# EAGLE design Motor Board (EAGLE 7.2.0)
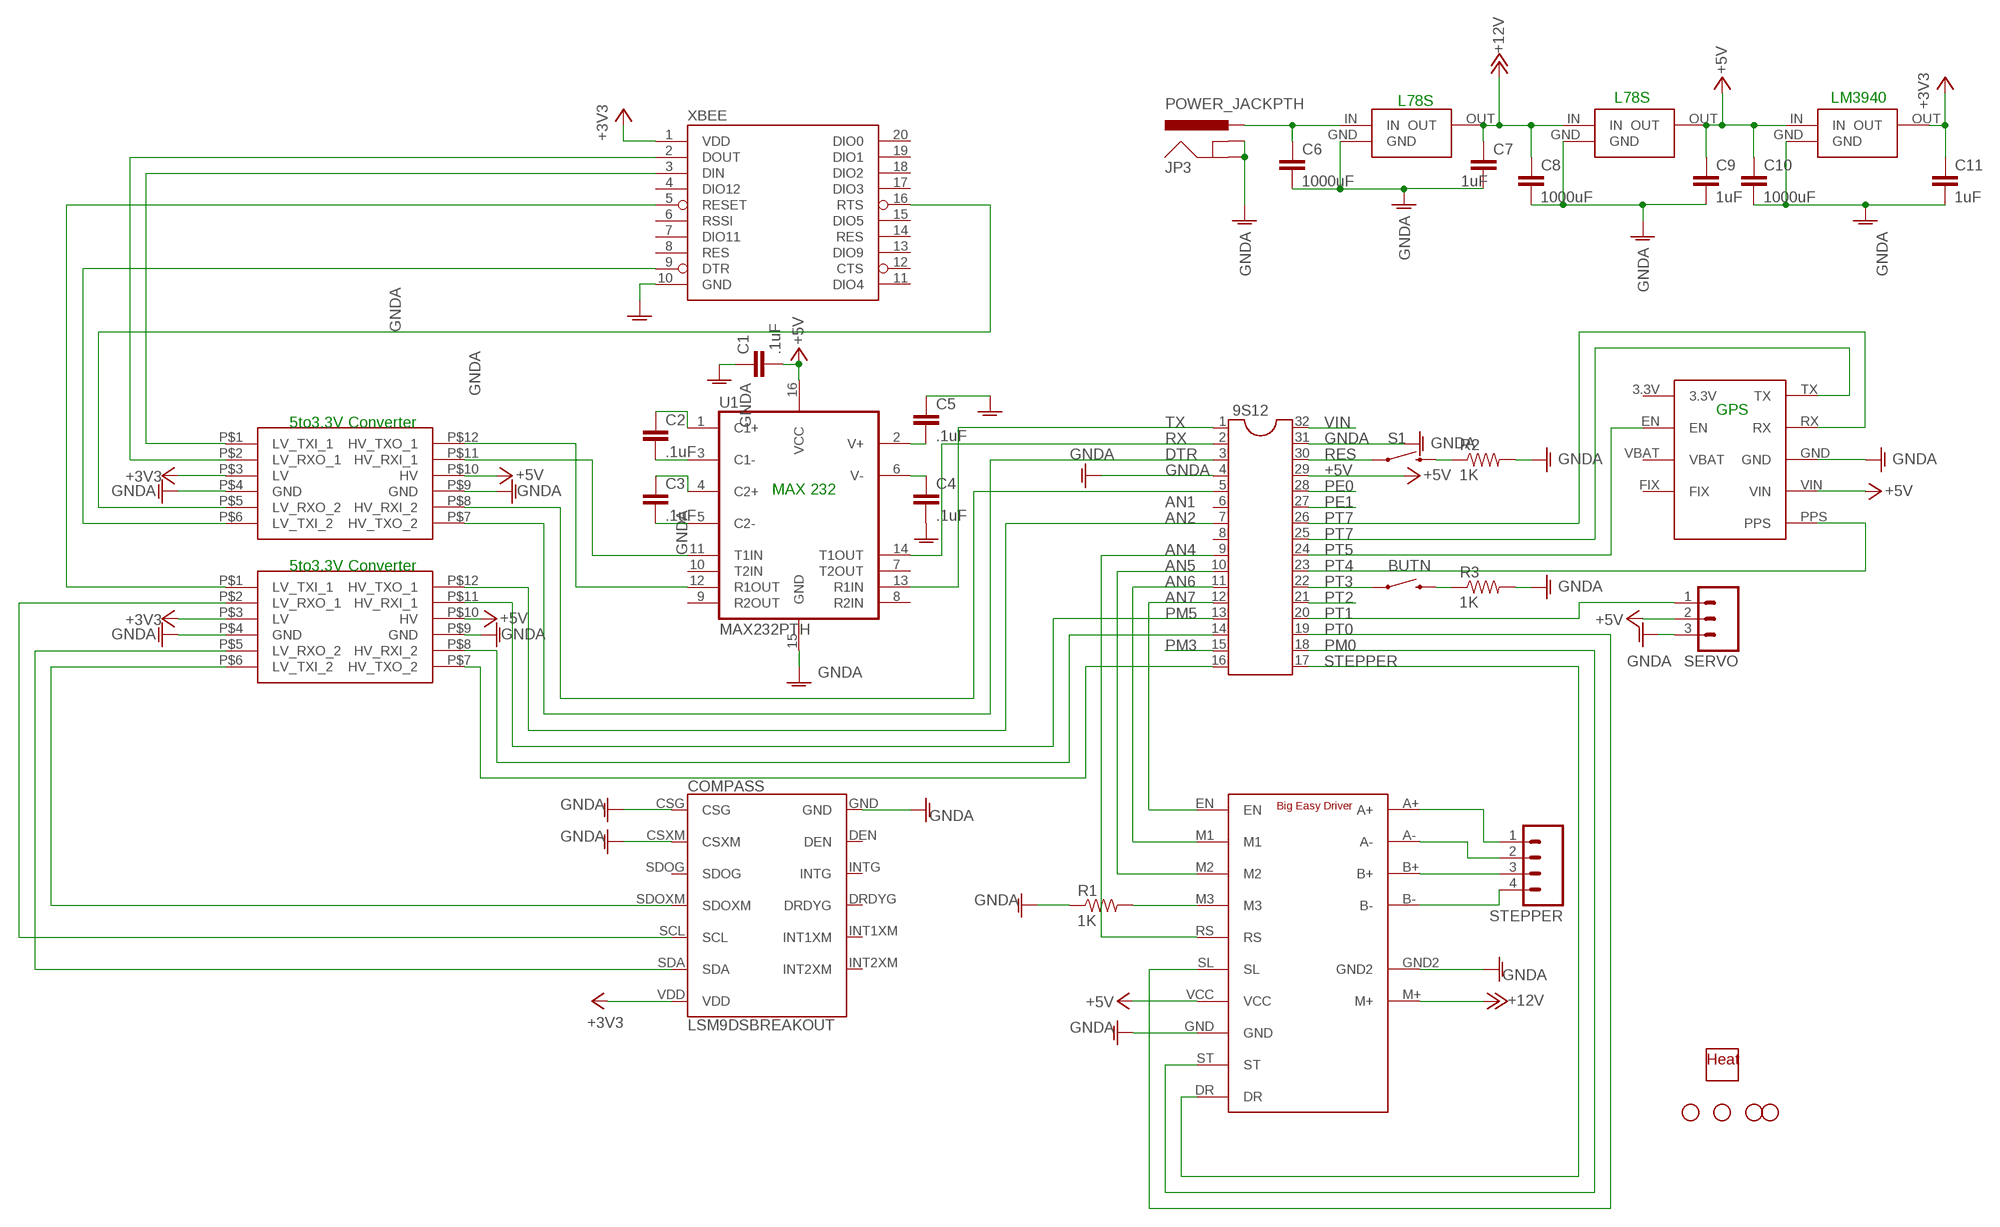
[diagram p0: schematic, sheet 1]

## Parts
9S12  DIL32  [DIL32]
BUTN  EXTERNALBUTTON  [EXTERNALBUTTON]
C1  .1uF  CAPPTH  [CAP-PTH-SMALL]
C2  .1uF  CAPPTH  [CAP-PTH-SMALL]
C3  .1uF  CAPPTH  [CAP-PTH-SMALL]
C4  .1uF  CAPPTH  [CAP-PTH-SMALL]
C5  .1uF  CAPPTH  [CAP-PTH-SMALL]
C6  1000uF  CAP_2000UF  [CAP]
C7  1uF  CAPPTH  [CAP-PTH-SMALL]
C8  1000uF  CAP_2000UF  [CAP]
C9  1uF  CAPPTH  [CAP-PTH-SMALL]
C10  1000uF  CAP_2000UF  [CAP]
C11  1uF  CAPPTH  [CAP-PTH-SMALL]
COMPASS  LSM9DSBREAKOUT  [IMUBREAKOUT]
JP3  POWER_JACKPTH  [POWER_JACK_PTH]
R1  1K  RESISTORPTH-1/4W  [AXIAL-0.4]
R2  1K  RESISTORPTH-1/4W  [AXIAL-0.4]
R3  1K  RESISTORPTH-1/4W  [AXIAL-0.4]
REG_5TO3.3  POWERREG_5TO3.3_NOHEAT  [POWERREG_NOHEAT]
REG_12TO5  POWERREG_12TO5  [POWERREG]
REG_18TO12  POWERREG18VTO12V  [POWERREG]
S1  SWITCH-MOMENTARY-2PTH  [TACTILE-PTH]
SERVO  M03PTH  [1X03]
STANDOFF1  STAND-OFF  [STAND-OFF]
STANDOFF2  STAND-OFF  [STAND-OFF]
STANDOFF3  STAND-OFF  [STAND-OFF]
STANDOFF4  STAND-OFF  [STAND-OFF]
STEPPER  M04NO_SILK_ALL_ROUND  [1X04_NO_SILK_ALL_ROUND]
U1  MAX232PTH  [DIL16]
U$1  5to3.3  LOGIC_LEVEL_CONVERTER  [LOGIC_LEVEL_CONVERTER]
U$2  5to3.3  LOGIC_LEVEL_CONVERTER  [LOGIC_LEVEL_CONVERTER]
U$3  BIGEASYDRIVER  [BIGEASYDRIVER]
U$4  GPS  [GPS]
U$9  HEATSINK  [HEATSINK]
XBEE  XBEE-1B1  [XBEE-1]

## Nets
+3V3: C11.1 COMPASS.VDD REG_5TO3.3.OUT U$1.P$3(LV) U$2.P$3(LV) XBEE.1(VDD)
+5V: 9S12.29 C1.2 C9.1 C10.1 REG_5TO3.3.IN REG_12TO5.OUT SERVO.2 U1.16(VCC) U$1.P$10(HV) U$2.P$10(HV) U$3.VCC U$4.VIN
+12V: C7.1 C8.1 REG_12TO5.IN REG_18TO12.OUT U$3.M+
A+: STEPPER.1 U$3.A+
A-: STEPPER.2 U$3.A-
AN0: U$2.P$5(LV_RXO_2) XBEE.16(RTS)
AN1: U$2.P$6(LV_TXI_2) XBEE.9(DTR)
AN2: U$1.P$1(LV_TXI_1) XBEE.5(RESET)
AN4: 9S12.9 U$3.RS
AN5: 9S12.10 U$3.M2
AN6: 9S12.11 U$3.M1
AN7: 9S12.12 U$3.EN
B-: STEPPER.4 U$3.B-
DTR: 9S12.3 U$2.P$7(HV_TXO_2)
GNDA: 9S12.4 9S12.31 C1.1 C4.2 C5.1 C6.2 C7.2 C8.2 C9.2 C10.2 C11.2 COMPASS.CSG COMPASS.CSXM COMPASS.GND JP3.GND JP3.GNDBREAK R1.P$1 R2.P$2 R3.P$2 REG_5TO3.3.GND REG_12TO5.GND REG_18TO12.GND SERVO.3 U1.15(GND) U$1.P$4(GND) U$1.P$9(GND) U$2.P$4(GND) U$2.P$9(GND) U$3.GND U$3.GND2 U$4.GND XBEE.10(GND)
N$1: COMPASS.SCL U$1.P$2(LV_RXO_1)
N$2: COMPASS.SDA U$1.P$5(LV_RXO_2)
N$4: 9S12.7 U$1.P$12(HV_TXO_1)
N$5: R1.P$2 U$3.M3
N$7: 9S12.1 U1.13(R1IN)
N$8: 9S12.25 U$4.TX
N$9: STEPPER.3 U$3.B+
N$10: 9S12.2 U1.14(T1OUT)
N$11: 9S12.5 U$2.P$8(HV_RXI_2)
N$12: U1.12(R1OUT) U$2.P$12(HV_TXO_1)
N$13: U1.11(T1IN) U$2.P$11(HV_RXI_1)
N$14: C2.1 U1.1(C1+)
N$15: C2.2 U1.3(C1-)
N$16: C3.2 U1.5(C2-)
N$17: C3.1 U1.4(C2+)
N$18: C5.2 U1.2(V+)
N$19: C4.1 U1.6(V-)
N$20: R2.P$1 S1.3
N$21: C6.1 JP3.PWR REG_18TO12.IN
N$22: BUTN.2 R3.P$1
PE0: 9S12.28
PE1: 9S12.27
PM0: 9S12.18 U$3.ST
PM2: 9S12.16 U$1.P$7(HV_TXO_2)
PM2_NEW: COMPASS.SDOXM U$1.P$6(LV_TXI_2)
PM3: 9S12.15
PM4: 9S12.14 U$1.P$8(HV_RXI_2)
PM5: 9S12.13 U$1.P$11(HV_RXI_1)
PT0: 9S12.19 U$3.SL
PT1: 9S12.20 SERVO.1
PT2: 9S12.21
PT3: 9S12.22 BUTN.1
PT4: 9S12.23 U$4.PPS
PT5: 9S12.24 U$4.EN
PT7: 9S12.26 U$4.RX
RES: 9S12.30 S1.1
RX: U$2.P$2(LV_RXO_1) XBEE.2(DOUT)
STEPPER: 9S12.17 U$3.DR
TX: U$2.P$1(LV_TXI_1) XBEE.3(DIN)
VIN: 9S12.32
Unconnected: 9S12.6 9S12.8 COMPASS.DEN COMPASS.DRDYG COMPASS.INT1XM COMPASS.INT2XM COMPASS.INTG COMPASS.SDOG U1.7(T2OUT) U1.8(R2IN) U1.9(R2OUT) U1.10(T2IN) U$4.3.3V U$4.FIX U$4.VBAT XBEE.4(DIO12) XBEE.6(RSSI) XBEE.7(DIO11) XBEE.8(RES) XBEE.11(DIO4) XBEE.12(CTS) XBEE.13(DIO9) XBEE.14(RES) XBEE.15(DIO5) XBEE.17(DIO3) XBEE.18(DIO2) XBEE.19(DIO1) XBEE.20(DIO0)

## Notes on the sheet
- L78S | L78S | LM3940
- GPS
- 5to3.3V Converter
- MAX 232
- 5to3.3V Converter

## Library data of the parts
9S12 = ic-package:DIL32: Dual In Line
BUTN = ECE 362:EXTERNALBUTTON
C1-C5 C7 C9 C11 = SparkFun-Capacitors:CAP: Capacitor Standard 0603 ceramic capacitor, and 0.1" leaded capacitor.
C6 C8 C10 = ECE 362:CAP_2000UF
COMPASS = ECE 362:LSM9DSBREAKOUT: LSM9DS0 Breakout Board SparkFun's 9 Degrees of Freedom IMU Breakout board
JP3 = SparkFun-Connectors:POWER_JACK: Power Jack This is the standard 5.5mm barrel jack for power. The PTH is the most common, proven, reliable, footprint. The Slot footprint only works if the mill layer is transmitted to the PCB fab house so be warned. Mating wall wart : TOL-00298 (and others); PROD_ID: CONN-08197
R1-R3 = SparkFun-Passives:RESISTOR: Resistor Basic schematic elements and footprints for 0603, 1206, and PTH resistors.
REG_5TO3.3 = ECE 362:POWERREG_5TO3.3_NOHEAT
REG_12TO5 = ECE 362:POWERREG_12TO5
REG_18TO12 = ECE 362:POWERREG18VTO12V
S1 = SparkFun-Electromechanical:SWITCH-MOMENTARY-2: Various NO switches- pushbuttons, reed, etc; PROD_ID: SWCH-08441
SERVO = SparkFun-Connectors:M03: Header 3 Standard 3-pin 0.1" header. Use with straight break away headers (SKU : PRT-00116), right angle break away headers (PRT-00553), swiss pins (PRT-00743), machine pins (PRT-00117), and female headers (PRT-00115). Molex polarized connector foot print use with SKU : PRT-08232 with associated crimp pins and housings.
STANDOFF1-STANDOFF4 = SparkFun-Electromechanical:STAND-OFF: #4 Stand Off This is the mechanical footprint for a #4 phillips button head screw. Use the keepout ring to avoid running the screw head into surrounding components. SKU : PRT-00447
STEPPER = SparkFun-Connectors:M04: Header 4 Standard 4-pin 0.1" header. Use with straight break away headers (SKU : PRT-00116), right angle break away headers (PRT-00553), swiss pins (PRT-00743), machine pins (PRT-00117), and female headers (PRT-00115). Molex polarized connector foot print use with SKU : PRT-08231 with associated crimp pins and housings. 1MM SMD Version SKU: PRT-10208
U1 = SparkFun-DigitalIC:MAX232: RS232 Transceiver Very common IC. This is generically called 'MAX232', but works with the 3V equivalent MAX3232 generic ICs. Field tested and mother approved. Spark Fun Electronics SKU : COM-00316 (DIP) and COM-00589 (SMD)
U$1 U$2 = SparkFun-Boards:LOGIC_LEVEL_CONVERTER: Logic Level Converter (3.3v - 5v) https://www.sparkfun.com/products/8745
U$3 = ECE 362:BIGEASYDRIVER: Big Easy Driver Spark Fun breakout board for stepper motors
U$4 = ECE 362:GPS: Adafruit Ultimate GPS Breakout Adafruit breakout v3
U$9 = ECE 362:HEATSINK
XBEE = SparkFun-RF:XBEE-1: Xbee module footprints

## Board
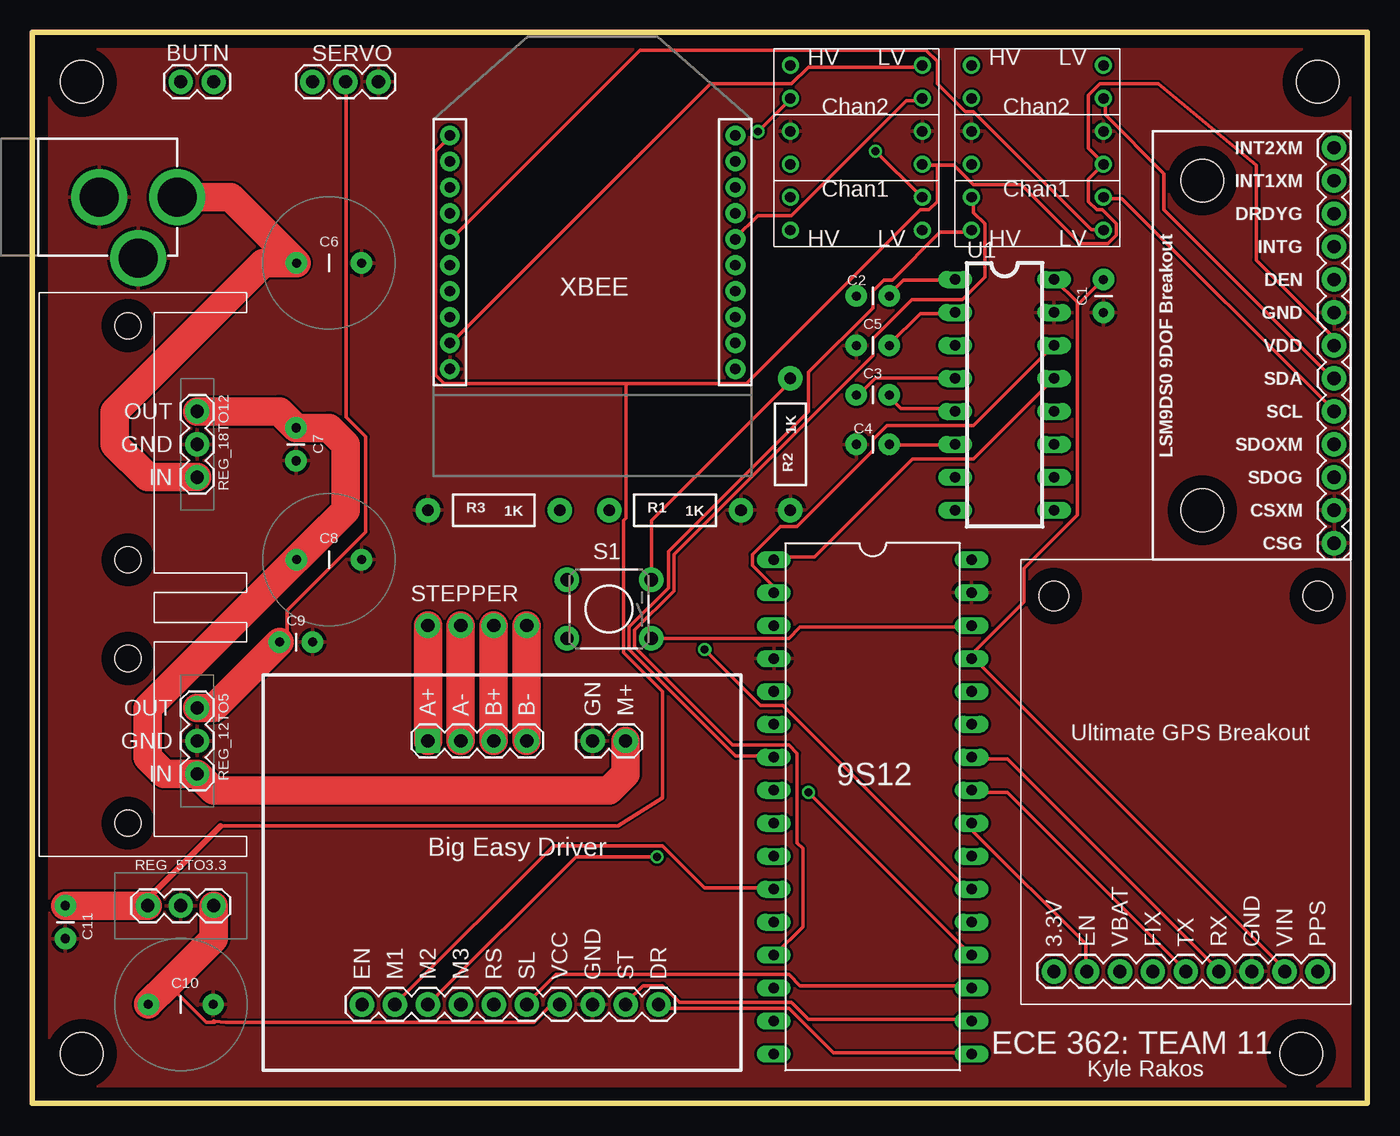
[diagram p1: board, top side]
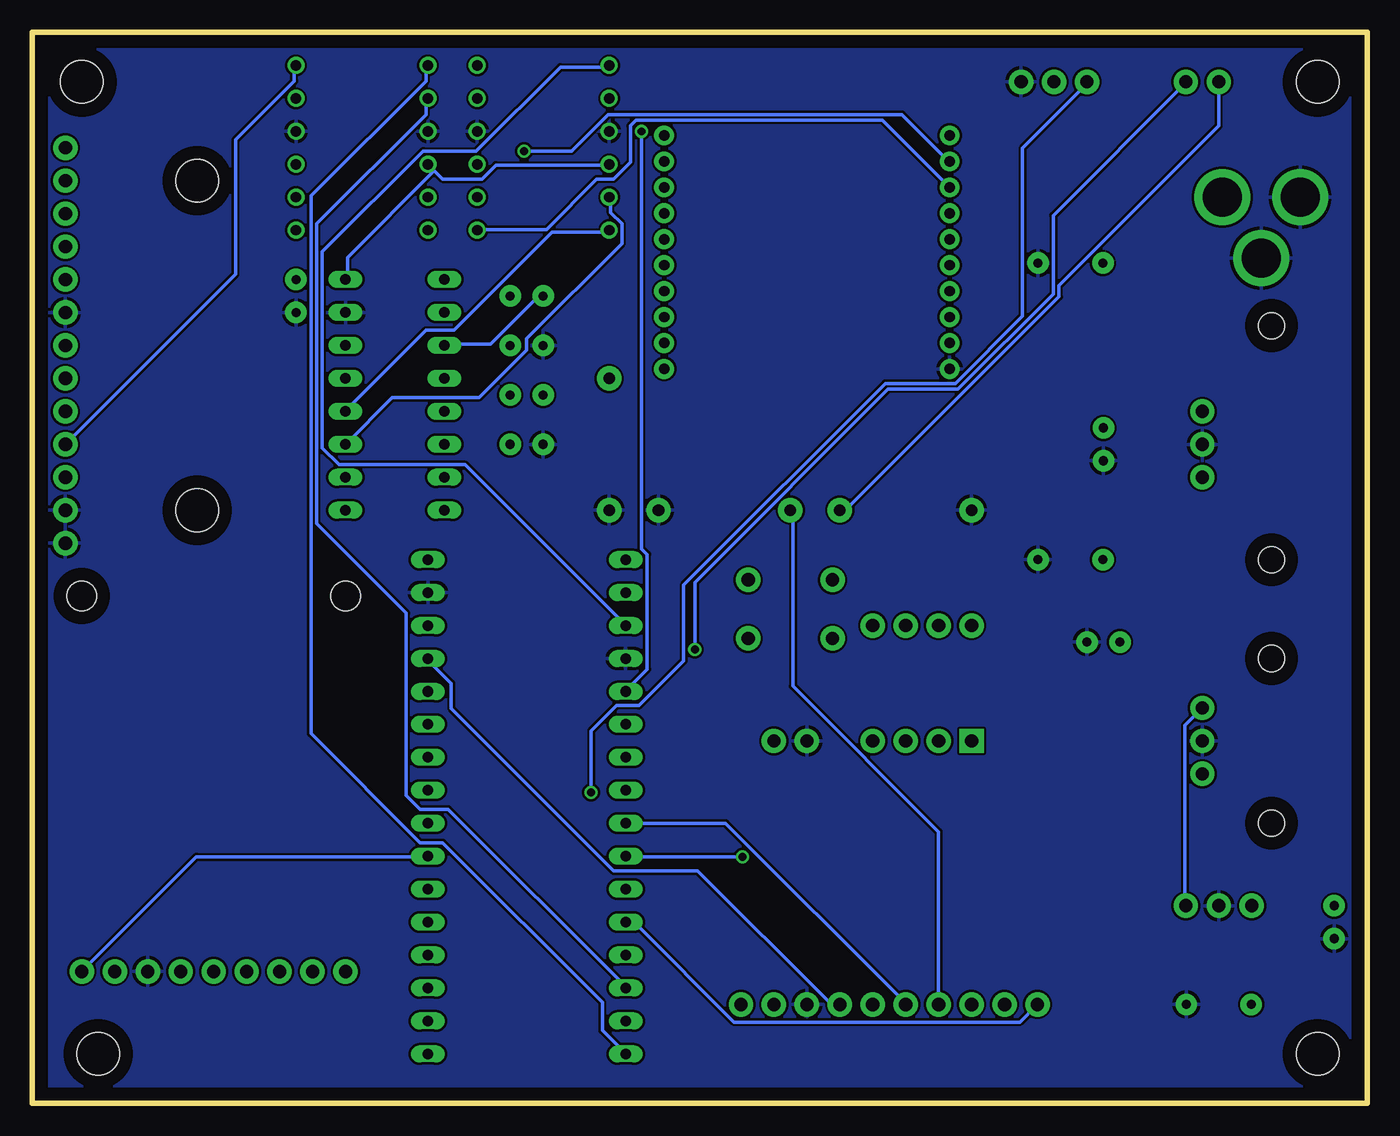
[diagram p2: board, bottom side, seen from below]

Size 102.87 x 82.55 mm. Coordinates in mm from the lower left corner, seen from the top.
Outline: 102.87,82.55 0,82.55 0,0 102.87,0 102.87,82.55
Copper layers (1*16): Top 0.035mm / dielectric 1.5mm / Bottom 0.035mm
Design rules "default *": minimum track width 10mil, minimum drill 24mil, track to track 7mil, track to pad 7mil, pad to pad 8mil, via to via 8mil, smd to smd 8mil, copper to edge 40mil, drill to drill 8mil, minimum pad ring 10mil, minimum via ring 8mil, stop-mask expansion 4mil, vias tented up to drill 0mil, thermal gap 10mil

### Footprints (pad centres in the part's own frame; a part is rotated, then mirrored left to right if it is on the bottom)
DIL32 = drill 0.813 long: 1 -19.05,-7.62; 2 -16.51,-7.62; 3 -13.97,-7.62; 4 -11.43,-7.62; 5 -8.89,-7.62; 6 -6.35,-7.62; 7 -3.81,-7.62; 8 -1.27,-7.62; 9 1.27,-7.62; 10 3.81,-7.62; 11 6.35,-7.62; 12 8.89,-7.62; 13 11.43,-7.62; 14 13.97,-7.62; 15 16.51,-7.62; 16 19.05,-7.62; 17 19.05,7.62; 18 16.51,7.62; 19 13.97,7.62; 20 11.43,7.62; 21 8.89,7.62; 22 6.35,7.62; 23 3.81,7.62; 24 1.27,7.62; 25 -1.27,7.62; 26 -3.81,7.62; 27 -6.35,7.62; 28 -8.89,7.62; 29 -11.43,7.62; 30 -13.97,7.62; 31 -16.51,7.62; 32 -19.05,7.62
EXTERNALBUTTON = drill 1.016 pad 1.88: 1 1.27,1.27; 2 3.81,1.27
CAP-PTH-SMALL = drill 0.7 pad 1.651: 1 0,0; 2 2.54,0
CAP = drill 0.7 pad 1.651: 1 1.31,1.27; 2 6.31,1.27
IMUBREAKOUT = drill 1.016 pad 1.88: CSG -22.86,-3.81; CSXM -20.32,-3.81; DEN -2.54,-3.81; DRDYG 2.54,-3.81; GND -5.08,-3.81; INT1XM 5.08,-3.81; INT2XM 7.62,-3.81; INTG 0,-3.81; SCL -12.7,-3.81; SDA -10.16,-3.81; SDOG -17.78,-3.81; SDOXM -15.24,-3.81; VDD -7.62,-3.81 | hole 3.302: -20.32,6.35; 5.08,6.35
POWER_JACK_PTH = drill 2.997 pad 4.318: GND 0,7.7; GNDBREAK 4.7,10.7; PWR 0,13.7
AXIAL-0.4 = drill 0.9 pad 1.88: P$1 -5.08,0; P$2 5.08,0
POWERREG_NOHEAT = drill 1.016 pad 1.88: GND 5.08,2.54; IN 2.54,2.54; OUT 7.62,2.54
POWERREG = drill 1.016 pad 1.88: GND 5.08,1.27; IN 2.54,1.27; OUT 7.62,1.27
TACTILE-PTH = drill 1.016 pad 1.88: 1 -3.251,2.261; 2 3.251,2.261; 3 -3.251,-2.261; 4 3.251,-2.261
1X03 = drill 1.016 pad 1.88: 1 0,0; 2 2.54,0; 3 5.08,0
STAND-OFF = hole 3.302: 0,0
1X04_NO_SILK_ALL_ROUND = drill 1.016 pad 1.88: 1 0,0; 2 2.54,0; 3 5.08,0; 4 7.62,0
DIL16 = drill 0.813 long: 1 -8.89,-3.81; 2 -6.35,-3.81; 3 -3.81,-3.81; 4 -1.27,-3.81; 5 1.27,-3.81; 6 3.81,-3.81; 7 6.35,-3.81; 8 8.89,-3.81; 9 8.89,3.81; 10 6.35,3.81; 11 3.81,3.81; 12 1.27,3.81; 13 -1.27,3.81; 14 -3.81,3.81; 15 -6.35,3.81; 16 -8.89,3.81
LOGIC_LEVEL_CONVERTER = drill 0.8: P$1 1.27,13.97; P$2 1.27,11.43; P$3 1.27,8.89; P$4 1.27,6.35; P$5 1.27,3.81; P$6 1.27,1.27; P$7 11.43,1.27; P$8 11.43,3.81; P$9 11.43,6.35; P$10 11.43,8.89; P$11 11.43,11.43; P$12 11.43,13.97
BIGEASYDRIVER = drill 1.016 pad 1.88 square: A+ 3.81,7.62 | drill 1.016 pad 1.88: A- 6.35,7.62; B+ 8.89,7.62; B- 11.43,7.62; DR 21.59,-12.7; EN -1.27,-12.7; GND 16.51,-12.7; GND2 16.51,7.62; M1 1.27,-12.7; M2 3.81,-12.7; M3 6.35,-12.7; M+ 19.05,7.62; RS 8.89,-12.7; SL 11.43,-12.7; ST 19.05,-12.7; VCC 13.97,-12.7
GPS = drill 1.016 pad 1.88: 3.3V 2.54,2.54; EN 5.08,2.54; FIX 10.16,2.54; GND 17.78,2.54; PPS 22.86,2.54; RX 15.24,2.54; TX 12.7,2.54; VBAT 7.62,2.54; VIN 20.32,2.54 | hole 2.286: 2.54,31.496; 22.86,31.496
HEATSINK = hole 2.032: 2.54,9.144; 15.24,9.144; 22.86,9.144; 40.894,9.144
XBEE-1 = drill 0.8 pad 1.524: 1 -11,20; 2 -11,18; 3 -11,16; 4 -11,14; 5 -11,12; 6 -11,10; 7 -11,8; 8 -11,6; 9 -11,4; 10 -11,2; 11 11,2; 12 11,4; 13 11,6; 14 11,8; 15 11,10; 16 11,12; 17 11,14; 18 11,16; 19 11,18; 20 11,20

### Placement (x,y rotation side)
9S12  64.77,22.86 270 top
BUTN  15.24,80.01 180 top
C1  82.55,60.96 90 top
C2  66.04,62.23 180 top
C3  63.5,54.61 0 top
C4  66.04,50.8 180 top
C5  63.5,58.42 0 top
C6  19.05,63.5 0 top
C7  20.32,52.07 270 top
C8  19.05,40.64 0 top
C9  19.05,35.56 0 top
C10  7.62,6.35 0 top
C11  2.54,15.24 270 top
COMPASS  96.52,66.04 90 top
JP3  -2.54,69.85 270 top
R1  49.53,45.72 180 top
R2  58.42,50.8 270 top
R3  35.56,45.72 180 top
REG_5TO3.3  16.51,17.78 180 top
REG_12TO5  13.97,22.86 90 top
REG_18TO12  13.97,45.72 90 top
S1  44.45,38.1 180 top
SERVO  21.59,78.74 0 top
STANDOFF1  3.81,3.81 0 top
STANDOFF2  97.79,3.81 0 top
STANDOFF3  3.81,78.74 0 top
STANDOFF4  99.06,78.74 0 top
STEPPER  30.48,36.83 0 top
U1  74.93,54.61 270 top
U$1  83.82,81.28 180 top
U$2  69.85,81.28 180 top
U$3  26.67,20.32 0 top
U$4  76.2,7.62 0 top
U$9  16.51,19.05 90 top
XBEE  43.18,54.61 0 top

### Tracks (layer width: path | path; a pad name or v marks a point on that pad's centre or on a via)
+3V3
  Top 0.254: 69.74,72.33 71.03,72.33 72.54,70.81 76.24,70.81 80.77,66.28 82.91,66.28 83.55,66.93 83.55,67.79 82.47,68.87 82.04,68.87 81.39,69.52 81.39,71.25 82.47,72.33 U$1.P$3 82.47,72.54 81.39,73.62 81.39,77.72 82.26,78.59 86.79,78.59 94.32,72.33 94.32,65.01 100.18,59.16 100.18,58.51 COMPASS.VDD | 69.74,72.33 68.66,72.33 U$2.P$3 | 45.77,55.49 55.05,55.49 68.44,68.87 69.09,68.87 69.74,69.52 69.74,72.33 | 45.77,55.49 31.74,55.49 31.09,56.13 31.09,73.41 32.17,74.49 XBEE.1 | 14.52,21.4 45.12,21.4 48.55,23.56 48.55,31.76 45.55,34.76 45.55,44.91 45.77,45.12 45.77,55.49
  Top 0.406: REG_5TO3.3.OUT 8.89,15.77 14.52,21.4
  Top 2.184: REG_5TO3.3.OUT C11.1
+5V
  Top 0.254: U$3.VCC 40.59,7.56 39.94,7.56 38.65,6.26 14.9,6.26 14.04,6.34 | 14.04,6.34 13.97,6.35 | SERVO.2 24.18,78.59 24.18,52.9 25.69,51.38 25.69,44.04 19.65,38 19.65,36.49 C9.1 | 72.54,34.33 72.54,34.76 76.43,38.65 76.43,41.24 80.53,45.34 80.53,61.53 | 80.53,61.53 80.53,61.75 78.8,63.48 U1.16 | 80.53,61.53 82.47,63.48 C1.2 | 72.54,34.33 96.51,10.36 U$4.VIN | 72.54,34.33 9S12.29 | 10.46,9.19 13.39,6.26 14.03,6.26 14.04,6.34
  Top 2.184: REG_12TO5.OUT 13.97,30.48 C9.1 | REG_5TO3.3.IN 13.97,12.7 10.46,9.19 8.93,7.66 C10.1
  Bottom 0.254: REG_12TO5.OUT 14.03,29.15 14.03,15.33 REG_5TO3.3.IN | U$1.P$10 71.89,71.89 | 71.89,71.89 71.25,71.25 68.22,71.25 67.14,72.33 58.51,72.33 U$2.P$10 | 71.89,71.89 78.59,65.2 78.59,63.69 U1.16 | U$3.VCC 40.8,7.77 41.45,7.77 51.6,17.92 58.08,17.92 70.6,30.44 70.6,32.38 72.33,34.11 9S12.29
+12V
  Top 2.184: REG_18TO12.OUT 19.05,53.34 C7.1 22.86,52.07 24.13,50.8 24.13,45.68 C8.1 22.82,44.41 8.89,30.48 8.89,26.67 10.16,25.4 REG_12TO5.IN 13.97,24.13 44.45,24.13 45.72,25.4 U$3.M+
A+
  Top 2.184: U$3.A+ STEPPER.1
A-
  Top 2.184: STEPPER.2 U$3.A-
AN0
  Top 0.254: U$2.P$5 68.44,77.29 67.36,77.29 58.51,68.44 55.92,68.44 54.19,66.71 XBEE.16
AN1
  Top 0.254: U$2.P$6 68.44,79.88 59.8,79.88 58.51,78.59 52.25,78.59 32.38,58.73 XBEE.9
AN2
  Top 0.254: U$1.P$1 82.47,67.36 81.61,67.36 72.54,76.43 71.89,76.43 69.74,78.59 69.74,80.31 68.87,81.18 46.85,81.18 32.38,66.71 XBEE.5
AN4
  Bottom 0.254: 9S12.9 49.44,21.59 35.62,7.77 U$3.RS
AN5  (via drill 0.61)
  Top 0.254: v48.15,19 41.88,19 30.66,7.77 U$3.M2
  Bottom 0.254: v48.15,19 57,19 9S12.10
AN6
  Top 0.254: 9S12.11 57,16.62 51.82,16.62 48.58,19.86 40.16,19.86 28.07,7.77 U$3.M1
AN7
  Bottom 0.254: 9S12.12 57,13.82 56.35,13.82 48.79,6.26 26.77,6.26 25.48,7.56 U$3.EN
B-
  Top 2.184: U$3.B- STEPPER.4
DTR
  Bottom 0.254: U$2.P$7 58.51,79.88 62.18,79.88 68.66,73.41 72.76,73.41 80.53,65.63 80.53,50.52 79.23,49.23 69.52,49.23 57.21,36.92 9S12.3
GNDA
  pour Bottom: -7.62,87.63 -7.62,-11.43 110.49,-11.43 110.49,83.82 110.49,90.17 -7.62,90.17
  pour Top: -6.35,86.36 -6.35,-24.13 111.76,-24.13 111.76,85.09 111.76,99.06 -6.35,99.06
N$1
  Top 0.254: U$1.P$2 82.69,69.74 83.98,69.74 100.18,53.54 COMPASS.SCL
N$2
  Top 0.254: U$1.P$5 82.69,77.29 82.69,76.21 87.22,71.68 87.22,68.87 100.18,55.92 COMPASS.SDA
N$4
  Top 0.254: U$1.P$12 72.33,67.14 69.95,67.14 66.28,63.48 65.63,63.48 64.77,62.61 64.77,61.32 59.8,56.35 59.8,53.33 49.01,42.53 49.01,39.73 45.99,36.7 45.99,34.98 54.19,26.77 57,26.77 9S12.7
N$5
  Bottom 0.254: U$3.M3 33.03,7.77 33.03,20.94 44.26,32.17 44.26,45.55 R1.P$2
N$7
  Top 0.254: 9S12.1 57.21,42.1 60.29,42.1 67.84,49.66 72.54,49.66 78.59,55.7 U1.13
N$8
  Top 0.254: 9S12.25 72.54,23.96 75.13,23.96 88.73,10.36 U$4.TX
N$9
  Top 2.184: U$3.B+ STEPPER.3
N$10
  Top 0.254: 9S12.2 57,39.51 57,39.94 55.49,41.45 55.49,42.32 57.65,44.48 58.94,44.48 64.77,50.3 64.77,51.17 65.85,52.25 72.54,52.25 78.59,58.29 U1.14
N$11  (via drill 0.61)
  Top 0.254: v55.92,74.92 58.29,77.29 U$2.P$8
  Bottom 0.254: v55.92,74.92 55.92,42.75 55.49,42.32 55.49,33.47 57,31.95 9S12.5
N$12
  Bottom 0.254: U$2.P$12 58.51,67.14 62.83,67.14 70.38,59.59 72.54,59.59 78.59,53.54 U1.12
N$13
  Bottom 0.254: U1.11 75.13,54.41 68.44,54.41 64.77,58.08 64.77,58.94 57.43,66.28 57.43,67.79 58.29,68.66 58.29,69.74 U$2.P$11
N$14
  Top 0.254: U1.1 71.03,63.48 67.14,63.48 66.06,62.4 C2.1
N$15
  Bottom 0.254: U1.3 71.03,58.51 67.58,58.51 63.69,62.4 C2.2
N$16
  Top 0.254: U1.5 71.03,53.54 66.93,53.54 66.06,54.41 C3.2
N$17
  Top 0.254: U1.4 71.03,55.92 64.99,55.92 63.69,54.62 C3.1
N$18
  Top 0.254: U1.2 71.03,60.88 68.44,60.88 66.06,58.51 C5.2
N$19
  Top 0.254: U1.6 71.03,50.74 66.06,50.74 C4.1
N$20
  Top 0.254: S1.3 47.71,40.37 47.71,44.91 58.51,55.7 R2.P$1
N$21
  Top 2.184: JP3.PWR 15.28,69.85 C6.1 17.78,64.77 6.35,53.34 6.35,50.8 8.89,48.26 REG_18TO12.IN
N$22
  Bottom 0.254: BUTN.2 11.44,78.59 11.44,75.35 23.75,63.04 23.75,62.18 40.16,45.77 40.59,45.77 R3.P$1
PM0
  Top 0.254: 9S12.18 72.33,6.48 59.8,6.48 58.51,7.77 49.87,7.77 48.58,9.07 47.07,9.07 45.77,7.77 U$3.ST
PM2
  Bottom 0.254: U$1.P$7 72.54,79.88 72.54,78.8 81.39,69.95 81.39,28.5 72.97,20.08 71.25,20.08 58.94,7.77 58.94,5.61 57.21,3.89 9S12.16
PM2_NEW
  Bottom 0.254: COMPASS.SDOXM 87.22,63.91 87.22,74.27 82.69,78.8 82.69,79.88 U$1.P$6
PM4
  Bottom 0.254: U$1.P$8 72.54,77.29 72.54,76.21 80.96,67.79 80.96,44.69 74.05,37.78 74.05,23.75 72.97,22.67 70.81,22.67 57.21,9.07 9S12.14
PM5
  Top 0.254: U$1.P$11 72.54,69.74 72.54,68.66 73.41,67.79 73.41,63.69 71.68,61.96 67.79,61.96 64.77,58.94 64.77,57.65 49.44,42.32 49.44,39.51 46.42,36.49 46.42,35.19 53.98,27.64 58.29,27.64 58.94,26.99 58.94,20.08 59.37,19.65 59.37,13.6 57.21,11.44 9S12.13
PT0
  Top 0.254: 9S12.19 72.33,9.07 59.16,9.07 58.29,9.93 40.37,9.93 38.21,7.77 U$3.SL
PT1  (via drill 0.61)
  Top 0.254: v59.8,23.96 72.33,11.44 9S12.20
  Bottom 0.254: v59.8,23.96 59.8,28.71 57.86,30.66 56.13,30.66 52.68,34.11 52.68,39.94 37.13,55.49 31.74,55.49 26.56,60.67 26.56,73.62 21.59,78.59 SERVO.1
PT3  (via drill 0.61)
  Top 0.254: v51.82,34.98 56.13,30.66 57.86,30.66 71.89,16.62 72.33,16.62 9S12.22
  Bottom 0.254: v51.82,34.98 51.82,40.16 36.92,55.05 31.52,55.05 24.18,62.4 24.18,68.44 14.03,78.59 BUTN.1
PT4
  Bottom 0.254: 9S12.23 72.54,19 90.25,19 98.88,10.36 U$4.PPS
PT5
  Top 0.254: 9S12.24 72.54,21.59 72.54,20.94 81.18,12.31 81.18,10.36 U$4.EN
PT7
  Top 0.254: 9S12.26 72.54,26.56 75.13,26.56 91.33,10.36 U$4.RX
RES
  Top 0.254: S1.1 58.29,35.84 59.16,36.7 72.33,36.7 9S12.30
RX  (via drill 0.61)
  Top 0.254: v64.99,73.41 68.44,69.95 U$2.P$2
  Bottom 0.254: v64.99,73.41 61.32,73.41 58.51,76.21 35.84,76.21 32.38,72.76 XBEE.2
STEPPER
  Top 0.254: 9S12.17 72.33,3.89 61.75,3.89 58.29,7.34 48.58,7.34 48.36,7.56 U$3.DR
TX
  Bottom 0.254: U$2.P$1 68.44,67.36 63.26,67.36 59.37,71.25 58.08,71.25 56.78,72.54 56.78,75.35 56.35,75.78 37.35,75.78 32.38,70.81 XBEE.3

### Text on the board
tPlace: ECE 362: TEAM 11 | Kyle Rakos